# EAGLE design Battery-Voltage-Measure (EAGLE 7.7.0)
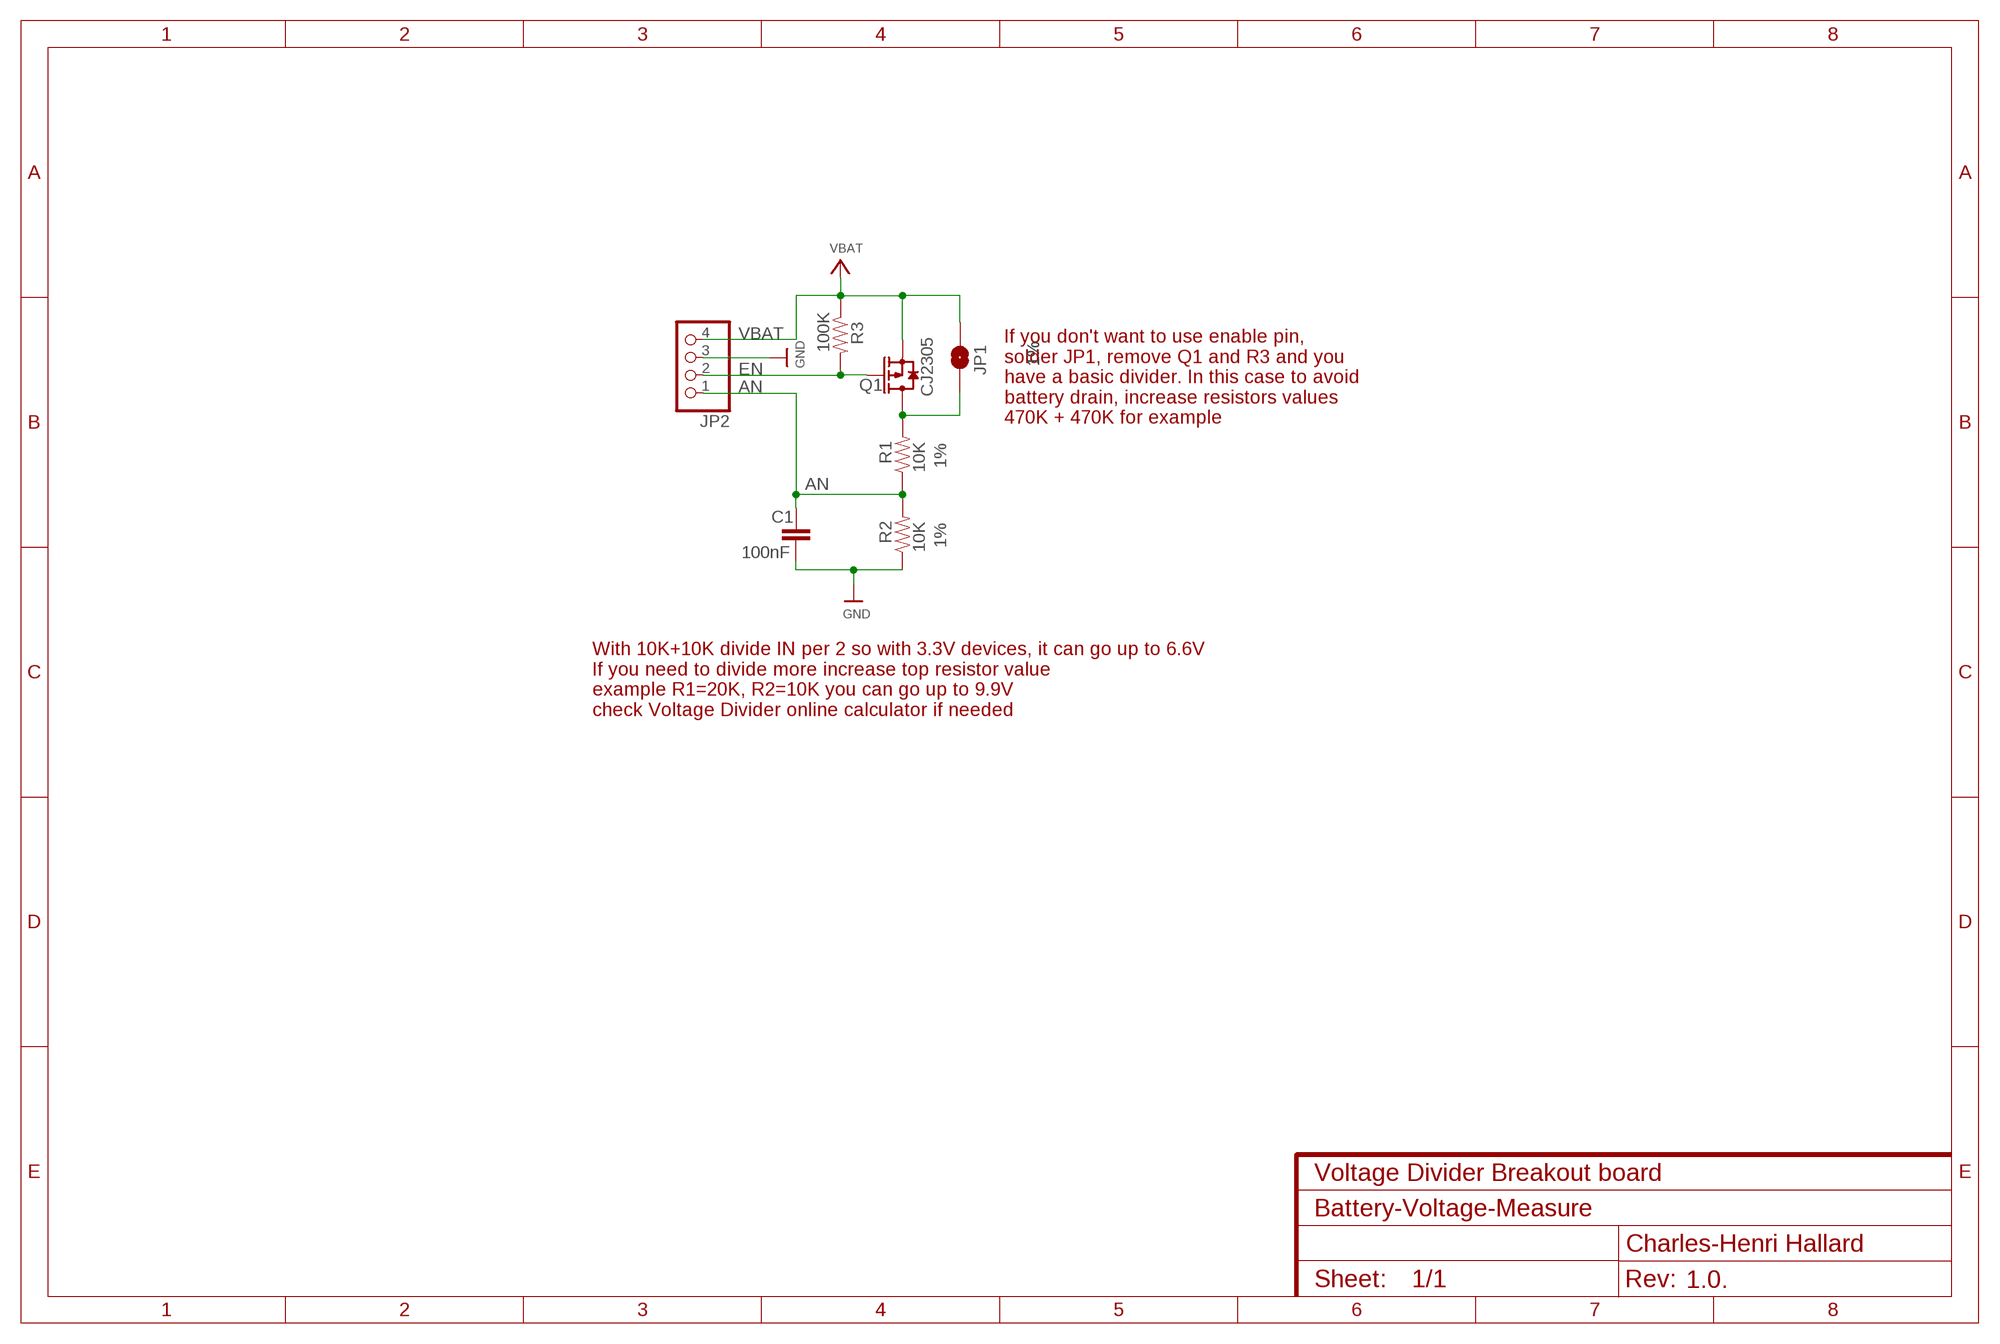
[diagram p0: schematic, sheet 1]
NAME (FRAME-A4L): CNAME: Voltage Divider Breakout board; CREVISION: 1.0.; DESIGNER: Charles-Henri Hallard

## Parts
C1  100nF  CAP0805-CAP  [0805-CAP]
JP1  JUMPER-SMT_2_NO_SILK  [SMT-JUMPER_2_NO_SILK]
JP2  HEADER-1X476MIL  [1X04_ROUND_76]
Q1  CJ2305  MOSFET-P-044021001  [SOT23]
R1  10K  RESISTOR0805-RES  [0805-RES]
R2  10K  RESISTOR0805-RES  [0805-RES]
R3  100K  RESISTOR0805-RES  [0805-RES]

## Nets
AN: C1.1 JP2.1 R1.1 R2.2
EN: JP2.2 Q1.1(G) R3.2
GND: C1.2 JP2.3 R2.1
IN0: JP1.1 Q1.3(D) R1.2
VBAT: JP1.2 JP2.4 Q1.2(S) R3.1

## Notes on the sheet
- 1% | 1%
- If you don't want to use enable pin, 
  solder JP1, remove Q1 and R3 and you
  have a basic divider. In this case to avoid
  battery drain, increase resistors values
  470K + 470K for example
- 1%
- 1%
- With 10K+10K divide IN per 2 so with 3.3V devices, it can go up to 6.6V
  If you need to divide more increase top resistor value
  example R1=20K, R2=10K you can go up to 9.9V
  check Voltage Divider online calculator if needed

## Library data of the parts
C1 = _c2h:CAP: Capacitor Standard 0603 ceramic capacitor, and 0.1" leaded capacitor.
JP1 = SparkFun-Jumpers:JUMPER-SMT_2_NO: Normally open jumper This jumper has two pads in close proximity to each other. Apply solder to close the connection. Round pads are easier to solder for beginners, but are a lot larger. SparkFun Product that uses the round pads: SparkFun EL Sequencer <https://www.sparkfun.com/products/12781>
JP2 = microbuilder:HEADER-1X4: PIN HEADER
Q1 = seeed-OPL:MOSFET-P: CJ2305：SMD MOSFET P-CH 8V-4.1A
R1 R2 = _c2h:RESISTOR: Resistor Basic schematic elements and footprints for 0603, 1206, and PTH resistors.
R3 = LowPowerLab:RESISTOR: Resistor Basic schematic elements and footprints for 0603, 1206, and PTH resistors.

## Net classes
1 power: width 0.203 mm, drill 0.305 mm, clearance 0.152 mm
2 GND: width 0.203 mm, drill 0.305 mm, clearance 0.152 mm

## Board
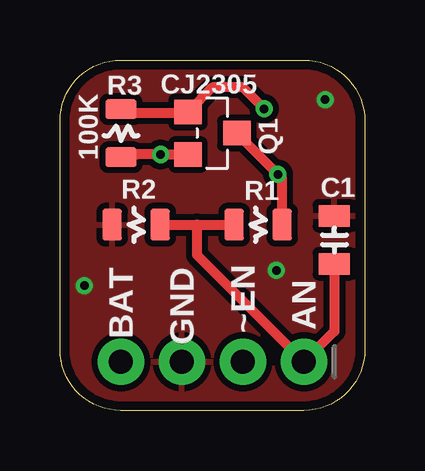
[diagram p1: board, top side]
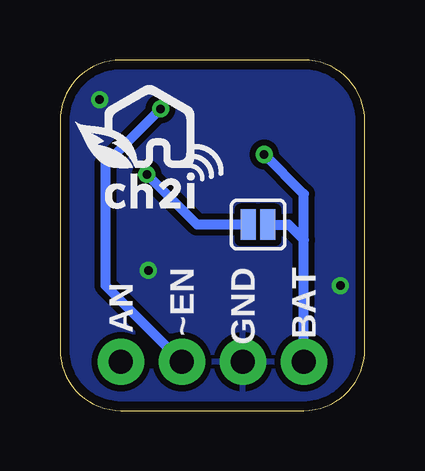
[diagram p2: board, bottom side, seen from below]

Size 12.7 x 14.61 mm. Coordinates in mm from the lower left corner, seen from the top.
Outline: 12.7,12.07 12.7,2.54 arc-90 10.16,0 2.54,0 arc-90 0,2.54 0,12.07 arc-90 2.54,14.61 10.16,14.61 arc-90 12.7,12.07
Copper layers (1*16): Top 0.0356mm / dielectric 1.5011mm / Bottom 0.0356mm
Design rules "PCBs_io": minimum track width 6mil, minimum drill 13mil, track to track 6mil, track to pad 6mil, pad to pad 6mil, via to via 6mil, smd to smd 6mil, copper to edge 15mil, drill to drill 6mil, minimum pad ring 7mil, minimum via ring 7mil, stop-mask expansion 3mil, vias tented up to drill 40mil, thermal gap 10mil

### Footprints (pad centres in the part's own frame; a part is rotated, then mirrored left to right if it is on the bottom)
0805-CAP = smd 0.902 x 1.3: 1 -1,0; 2 1,0
SMT-JUMPER_2_NO_SILK = smd 0.635 x 1.27: 1 -0.406,0; 2 0.406,0
1X04_ROUND_76 = drill 1 pad 1.93: 1 -3.81,0; 2 -1.27,0; 3 1.27,0; 4 3.81,0
SOT23 = smd 1.016 x 1.143: 1 -0.889,-1.016; 2 0.889,-1.016; 3 0,1.016
0805-RES = smd 0.8 x 1.3: 1 -1,0; 2 1,0

### Placement (x,y rotation side)
C1  11.43,7.11 90 top
JP1  4.45,7.75 0 bottom
JP2  6.35,2.03 180 top
Q1  6.35,11.56 270 top
R1  8.26,7.75 0 top
R2  3.17,7.75 0 top
R3  2.54,11.56 90 top
U$5  [LOGO_C2I_015]  12.06,8.38 0 bottom

### Tracks (layer width: path | path; a pad name or v marks a point on that pad's centre or on a via)
AN
  Top 0.406: C1.1 11.43,3.3 JP2.1 5.71,6.48 5.71,7.75 | R2.2 5.71,7.75 | 5.71,7.75 R1.1
EN  (via drill 0.36 pad 0.71)
  Top 0.406: R3.2 2.69,12.41 5.29,12.41 Q1.1 6.35,13.46 7.62,13.46 v8.51,12.57
  Bottom 0.406: JP2.2 10.79,5.21 10.79,10.29 v8.51,12.57
GND  (via drill 0.36 pad 0.71)
  other vias: 1.02,5.21 9.02,5.84 11.05,12.95
  pour Bottom (isolate 0.254): 13.97,15.24 13.97,-1.27 -1.27,-1.27 -1.27,15.24
  pour Top (isolate 0.254): -0.64,14.73 13.34,14.73 13.34,-0.51 -0.64,-0.51
IN0  (via drill 0.36 pad 0.71)
  Top 0.406: R1.2 9.26,9.67 v9.08,9.84 Q1.3
  Bottom 0.406: JP1.1 6.99,7.75 v9.08,9.84
VBAT  (via drill 0.36 pad 0.71)
  Top 0.406: R3.1 3.21,10.67 v4.19,10.67 Q1.2
  Bottom 0.406: JP2.4 2.54,7.11 | 2.54,7.11 2.54,9.02 v4.19,10.67 | JP1.2 3.17,7.75 2.54,7.11

### Text on the board
tPlace: BAT | GND | ~EN | AN
bPlace: BAT | GND | ~EN | AN